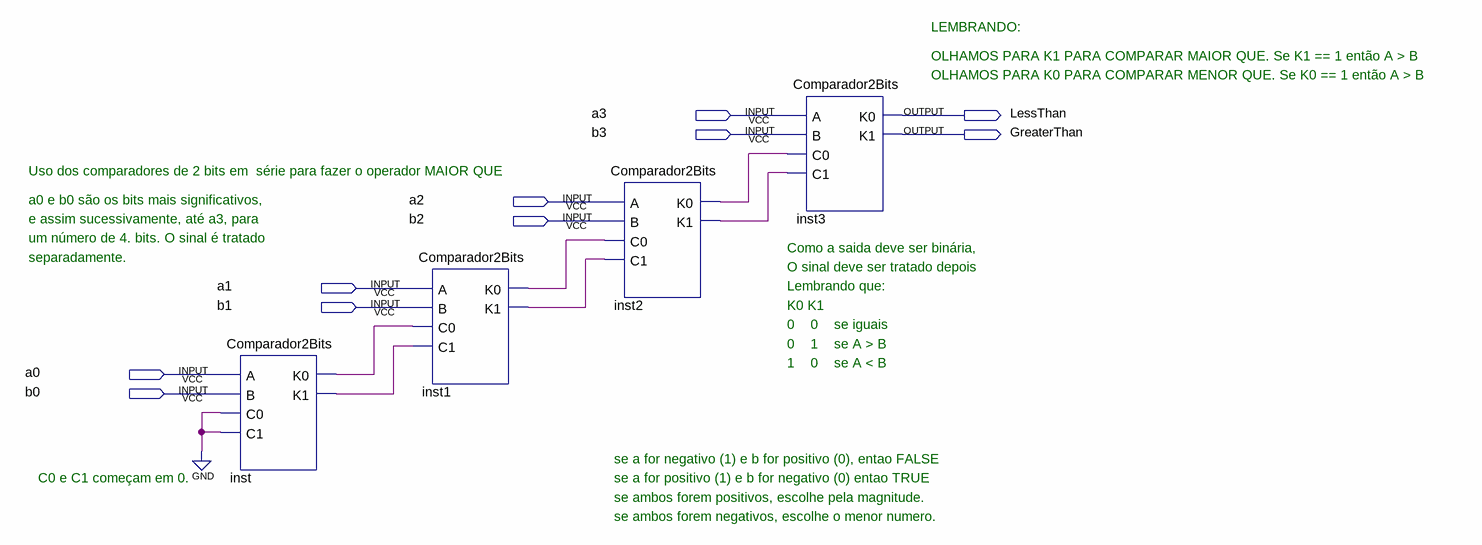
[diagram p0: schematic sheet]
// Quartus schematic ComparaMagnitude.bdf as structural Verilog: 4 symbols, 10 pins
module ComparaMagnitude (
  input  a3,
  input  b3,
  input  a2,
  input  b2,
  input  a1,
  input  b1,
  input  a0,
  input  b0,
  output LessThan,
  output GreaterThan
);

  wire inst1_k0, inst1_k1, inst2_k0, inst2_k1, inst_k0, inst_k1;

  Comparador2Bits inst (.A(a0), .B(b0), .C0(1'b0), .C1(1'b0), .K0(inst_k0), .K1(inst_k1));
  Comparador2Bits inst1 (.A(a1), .B(b1), .C0(inst_k0), .C1(inst_k1), .K0(inst1_k0), .K1(inst1_k1));
  Comparador2Bits inst2 (.A(a2), .B(b2), .C0(inst1_k0), .C1(inst1_k1), .K0(inst2_k0), .K1(inst2_k1));
  Comparador2Bits inst3 (.A(a3), .B(b3), .C0(inst2_k0), .C1(inst2_k1), .K0(LessThan), .K1(GreaterThan));

  // Notes on the sheet:
  //   LEMBRANDO:
  //   OLHAMOS PARA K1 PARA COMPARAR MAIOR QUE. Se K1 == 1 então A > B
  //   OLHAMOS PARA K0 PARA COMPARAR MENOR QUE. Se K0 == 1 então A > B
  //   Uso dos comparadores de 2 bits em  série para fazer o operador MAIOR QUE
  //   a0 e b0 são os bits mais significativos,
  //   e assim sucessivamente, até a3, para
  //   um número de 4. bits. O sinal é tratado
  //   Como a saida deve ser binária,
  //   separadamente.
  //   O sinal deve ser tratado depois
  //   Lembrando que:
  //   K0 K1
  //   0    0    se iguais
  //   0    1    se A > B
  //   1    0    se A < B
  //   se a for negativo (1) e b for positivo (0), entao FALSE
  //   C0 e C1 começam em 0.
  //   se a for positivo (1) e b for negativo (0) entao TRUE
  //   se ambos forem positivos, escolhe pela magnitude.
  //   se ambos forem negativos, escolhe o menor numero.
endmodule
